# Altium schematic sheet PSU.SchDoc: 3V3 LDO
size A4; DrawnBy: Damian Dolewski; Engineer: Damian Dolewski; DocumentNumber: 1; SheetNumber: 1; SheetTotal: 1
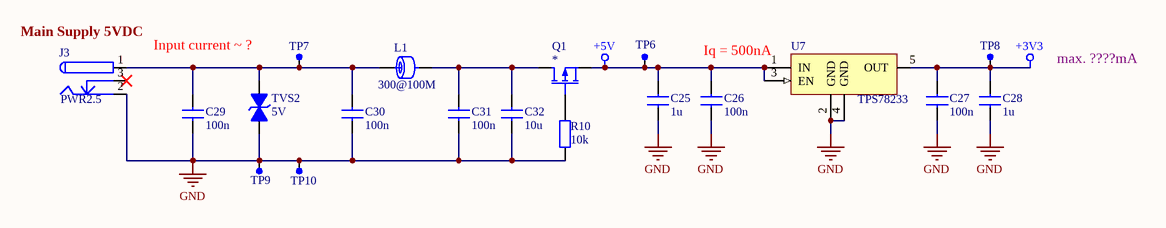
[diagram p0: PSU.SchDoc]

## Parts
C25  value 1u  [C_0805]  (hidden comment: Capacitor)
C26  value 100n  [C_0805]  (hidden comment: Capacitor)
C27  value 100n  [C_0805]  (hidden comment: Capacitor)
C28  value 1u  [C_0805]  (hidden comment: Capacitor)
C29  value 100n  [C_0805]  (hidden comment: Capacitor)
C30  value 100n  [C_0805]  (hidden comment: Capacitor)
C31  value 100n  [C_0805]  (hidden comment: Capacitor)
C32  value 10u  [C_0805]  (hidden comment: Capacitor)
J3  PWR2.5  [WE_WR_DC_694106301002]
L1  value 300@100M  [L_0805]  (hidden comment: 742792031)
Q1  MOSFET-P  [SOT-23]  (value not drawn)
R10  value 10k  [R_0805]  (hidden comment: Resistor)
TP6  TEST PAD  [PIN]  (value not drawn)
TP7  TEST PAD  [PIN]  (value not drawn)
TP8  TEST PAD  [PIN]  (value not drawn)
TP9  TEST PAD  [PIN]  (value not drawn)
TP10  TEST PAD  [PIN]  (value not drawn)
TVS2  value 5V  [D_1206]  (hidden comment: SMAJ5.0ALFCT-ND)
U7  TPS78233  [SOP5(6)]

## Nets
+3V3: C27.1 C28.1 TP8.1 U7.5(OUT)
+5V: C25.1 C26.1 Q1.2(S) TP6.1 U7.1(IN) U7.3(EN)
GND: C25.2 C26.2 C27.2 C28.2 C29.2 C30.2 C31.2 C32.2 J3.2 R10.1 TP9.1 TP10.1 TVS2.1(A) U7.2(GND) U7.4(GND)
NetC29_1: C29.1 C30.1 J3.1 L1.1 TP7.1 TVS2.2(K)
NetC31_1: C31.1 C32.1 L1.2 Q1.3(D)
NetQ1_1: Q1.1(G) R10.2

Not connected (* = marked no-connect by the designer): J3 3*

## Notes on the sheet
- (near J3) Main Supply 5VDC
- (near TP7) Input current ~ ?
- (near U7) Iq = 500nA
- max. ????mA
- Title:
- Size:
- A4
- Number:
- Revision:
- Date:
- File:
- Sheet
- of

## Library data of the parts
J3 = PWR2.5: Low Voltage Power Supply Connector; ComponentLink1Description: Manufacturer Link; ComponentLink1URL: http://domino.kycon.com/internet/Products.html; Value: PWR2.5
L1 = FB: Ferrite Bead
Q1 = MOSFET-P: P-Channel MOSFET; Value: *
TP6-TP10 = TEST_PAD: PAD 1.5mm
TVS2 = Transil
U7 = TPS78233: 150-mA, ultra-low quiescent qurrent (500 nA) low-dropout linear regulator; Value: TPS78233